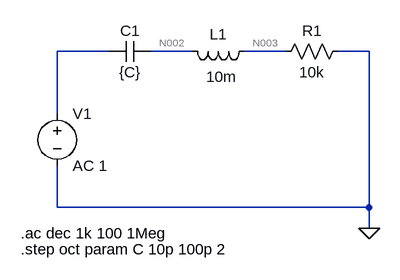
[diagram p0: schematic 2nd Order Resonant Circuit with Swept Component Values and Frequencies.asc]
2nd Order Resonant Circuit with Swept Component Values and Frequencies.asc, the LTspice schematic file:
Version 4
SHEET 1 880 680
WIRE 112 176 32 176
WIRE 240 176 176 176
WIRE 384 176 320 176
WIRE 512 176 464 176
WIRE 32 272 32 176
WIRE 32 416 32 352
WIRE 512 416 512 176
WIRE 512 416 32 416
WIRE 512 448 512 416
FLAG 512 448 0
SYMBOL cap 112 192 R270
WINDOW 0 32 32 VTop 2
WINDOW 3 0 32 VBottom 2
SYMATTR InstName C1
SYMATTR Value {C}
SYMBOL ind 336 160 R90
WINDOW 0 5 56 VBottom 2
WINDOW 3 39 51 VTop 2
SYMATTR InstName L1
SYMATTR Value 10m
SYMBOL res 480 160 R90
WINDOW 0 0 56 VBottom 2
WINDOW 3 32 56 VTop 2
SYMATTR InstName R1
SYMATTR Value 10k
SYMBOL voltage 32 256 R0
WINDOW 123 0 0 Left 0
WINDOW 39 0 0 Left 0
SYMATTR InstName V1
SYMATTR Value AC 1
TEXT -24 456 Left 2 !.ac dec 1k 100 1Meg
TEXT -24 480 Left 2 !.step oct param C 10p 100p 2

The netlist it stands for:
* 2nd Order Resonant Circuit with Swept Component Values and Frequencies.asc
C1 N001 N002 {C}
L1 N003 N002 10m
R1 0 N003 10k
V1 N001 0 AC 1
.ac dec 1k 100 1Meg
.step oct param C 10p 100p 2
.backanno
.end

* Results of the author's LTspice run, read from the files saved beside the schematic
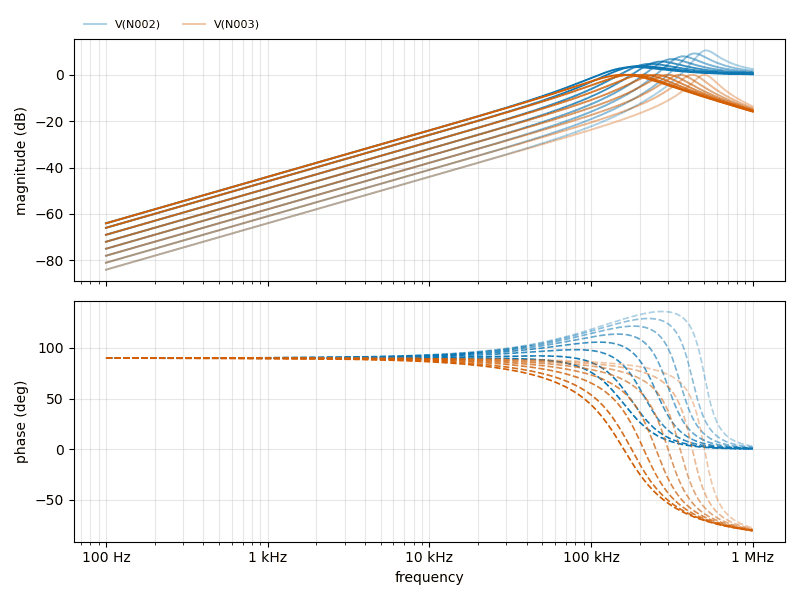
[diagram p1: AC Analysis of 2nd Order Resonant Circuit with Swept Component Values and Frequencies.asc, plotted from the saved traces]
* AC Analysis, 8 runs:
*   V(N002) [run 1]: -84.04 dB at 100 Hz, 2.45 dB at 1 MHz, peak 10.50 dB at 515.2 kHz, 3 dB below the peak at 446.4 kHz and 625.9 kHz
*   V(N002) [run 2]: -81.03 dB at 100 Hz, 1.66 dB at 1 MHz, peak 9.19 dB at 437.5 kHz, 3 dB below the peak at 368.9 kHz and 557.3 kHz
*   V(N002) [run 3]: -78.02 dB at 100 Hz, 1.14 dB at 1 MHz, peak 7.94 dB at 371.5 kHz, 3 dB below the peak at 304.2 kHz and 505.5 kHz
*   V(N002) [run 4]: -75.01 dB at 100 Hz, 0.79 dB at 1 MHz, peak 6.76 dB at 317.7 kHz, 3 dB below the peak at 250 kHz and 471 kHz
*   V(N002) [run 5]: -72.00 dB at 100 Hz, 0.55 dB at 1 MHz, peak 5.68 dB at 272.3 kHz, 3 dB below the peak at 204.6 kHz and 456.9 kHz
*   V(N002) [run 6]: -68.98 dB at 100 Hz, 0.39 dB at 1 MHz, peak 4.70 dB at 234.4 kHz, 3 dB below the peak at 166.3 kHz and 474.4 kHz
*   V(N002) [run 7]: -65.97 dB at 100 Hz, 0.27 dB at 1 MHz, peak 3.83 dB at 203.2 kHz, 3 dB below the peak at 133.9 kHz and 569.7 kHz
*   V(N002) [run 8]: -64.04 dB at 100 Hz, 0.22 dB at 1 MHz, peak 3.33 dB at 186.2 kHz, 3 dB below the peak at 115.8 kHz and 816.6 kHz
*   V(N003) [run 1]: -84.04 dB at 100 Hz, -13.62 dB at 1 MHz, peak -0.00 dB at 503.5 kHz, 3 dB below the peak at 430 kHz and 589.1 kHz
*   V(N003) [run 2]: -81.03 dB at 100 Hz, -14.41 dB at 1 MHz, peak -0.00 dB at 423.6 kHz, 3 dB below the peak at 351.1 kHz and 510.2 kHz
*   V(N003) [run 3]: -78.02 dB at 100 Hz, -14.93 dB at 1 MHz, peak -0.00 dB at 355.6 kHz, 3 dB below the peak at 285.1 kHz and 444.2 kHz
*   V(N003) [run 4]: -75.01 dB at 100 Hz, -15.28 dB at 1 MHz, peak -0.00 dB at 299.2 kHz, 3 dB below the peak at 230.1 kHz and 389.2 kHz
*   V(N003) [run 5]: -72.00 dB at 100 Hz, -15.52 dB at 1 MHz, peak -0.00 dB at 251.8 kHz, 3 dB below the peak at 184.4 kHz and 343.5 kHz
*   V(N003) [run 6]: -68.98 dB at 100 Hz, -15.68 dB at 1 MHz, peak -0.00 dB at 211.8 kHz, 3 dB below the peak at 146.5 kHz and 305.7 kHz
*   V(N003) [run 7]: -65.97 dB at 100 Hz, -15.80 dB at 1 MHz, peak -0.00 dB at 177.8 kHz, 3 dB below the peak at 115.3 kHz and 274.5 kHz
*   V(N003) [run 8]: -64.04 dB at 100 Hz, -15.86 dB at 1 MHz, peak -0.00 dB at 159.2 kHz, 3 dB below the peak at 98.36 kHz and 257.5 kHz